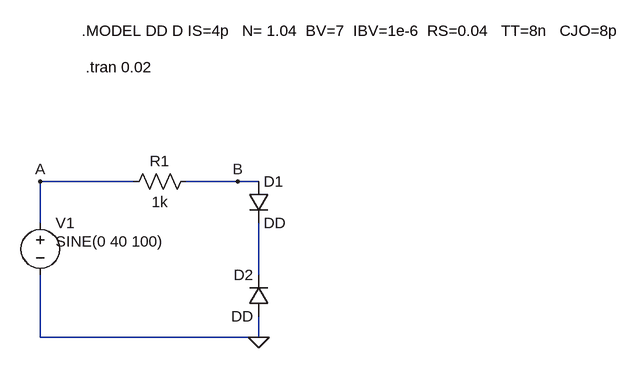
[diagram p0: schematic Draft2.asc]
Draft2.asc, the LTspice schematic file:
Version 4
SHEET 1 904 680
WIRE 80 208 -64 208
WIRE 240 208 160 208
WIRE 272 208 240 208
WIRE -64 272 -64 208
WIRE 272 352 272 272
WIRE -64 448 -64 352
WIRE 272 448 272 416
WIRE 272 448 -64 448
FLAG 272 448 0
FLAG -64 208 A
FLAG 240 208 B
SYMBOL voltage -64 256 R0
WINDOW 3 24 44 Left 2
WINDOW 123 0 0 Left 0
WINDOW 39 0 0 Left 0
SYMATTR InstName V1
SYMATTR Value SINE(0 40 100)
SYMBOL diode 256 208 R0
SYMATTR InstName D1
SYMATTR Value DD
SYMBOL diode 288 416 R180
WINDOW 0 24 64 Left 2
WINDOW 3 24 0 Left 2
SYMATTR InstName D2
SYMATTR Value DD
SYMBOL res 176 192 R90
WINDOW 0 0 56 VBottom 2
WINDOW 3 32 56 VTop 2
SYMATTR InstName R1
SYMATTR Value 1k
TEXT 0 -24 Left 2 !.MODEL DD D IS=4p   N= 1.04  BV=7  IBV=1e-6  RS=0.04   TT=8n   CJO=8p
TEXT 6 32 Left 2 !.tran 0.02

The netlist it stands for:
* Draft2.asc
V1 A 0 SINE(0 40 100)
D1 B N001 DD
D2 0 N001 DD
R1 B A 1k
.model D D
.lib standard.dio
.MODEL DD D IS=4p   N= 1.04  BV=7  IBV=1e-6  RS=0.04   TT=8n   CJO=8p
.tran 0.02
.backanno
.end